# Altium schematic sheet Sheet1.SchDoc
size A4
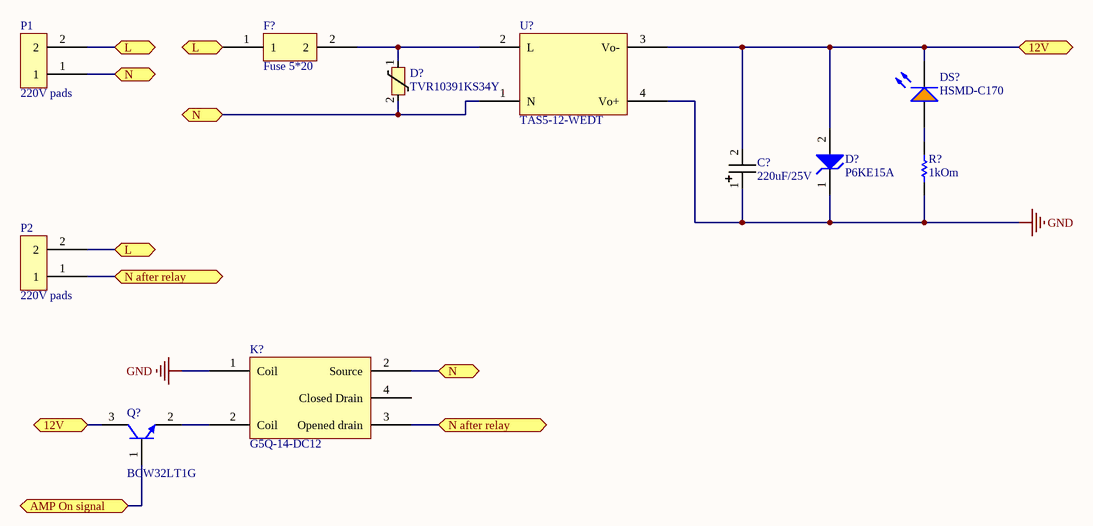
[diagram p0: Sheet1.SchDoc]

## Parts
(Parts that share a designator on the sheet are numbered #1, #2 ... from top to bottom, then left to right.)
C?  220uF/25V  [Capacitor 7*8]
D?#1  TVR10391KS34Y  [TVR10391KS34Y]
D?#2  P6KE15A  [ONSC-SURMETIC40-2-017AA-01]
DS?  HSMD-C170  [AVAG-HSMX-C170_V]
F?  Fuse 5*20  [Fuse 5*20]
K?  G5Q-14-DC12  [G5Q-14-DC12]
P1  220V pads  [220V pads]
P2  220V pads  [220V pads]
Q?  BCW32LT1G  [ONSC-SOT-23-3-318-08_V]
R?  1kOm  [RESC1608X55X30ML20T10]
U?  TAS5-12-WEDT  [TAS5-12-WEDT]

## Ports
12V (bidir), AMP On signal (bidir), L (bidir), N (bidir), N after relay (bidir)

## Nets
GND: C?.1 D?#2.1(K) K?.1(Coil) R?.1 U?.4(Vo+)
12V: C?.2 D?#2.2(A) DS?.2(K) Q?.3(C) U?.3(Vo-) ; port 12V
AMP On signal: Q?.1(B) ; port AMP On signal
L: F?.1 P1.2 P2.2 ; port L
N: D?#1.2 K?.2(Source) P1.1 U?.1(N) ; port N
N after relay: K?.3(Opened_drain) P2.1 ; port N after relay
NetD?#1_1: D?#1.1 F?.2 U?.2(L)
NetDS?_1: DS?.1(A) R?.2
NetK?_2: K?.2(Coil) Q?.2(E)

Not connected (* = marked no-connect by the designer): K? 4(Closed_Drain)

## Library data of the parts
C? = Capacitor 7*8
D?#2 = CMP-1061-00710-1: 600 W Peak Power Transient Voltage Suppressor, 2-Pin Surmetic(TM) 40, Pb-Free, Bulk Box; Manufacturer: On Semiconductor; PartNumber: P6KE15AG; PPK Max (W): 600; Direction: Unidirectional; V(BR) Typ (V): 15.05; IR Max (uA): 5; Packing: Bulk Box; ComponentLink2URL: http://www.onsemi.com/pub_link/Collateral/P6KE6.8A-D.PDF; ComponentLink1URL: http://www.onsemi.com/; DatasheetVersion: Rev. 10; ComponentLink2Description: Datasheet; ComponentLink3Description: Package Specification; Mounting Technology: Through Hole; PackageReference: SURMETIC40-2-017AA-01; ComponentLink1Description: Manufacturer URL; ComponentLink3URL: http://www.onsemi.cn/pub_link/Collateral/017AA.PDF; PackageVersion: Rev. O, 09/2005; RoHS: Pb-Free; PackageDescription: 2-Pin, Axial Lead, Diameter 3.49 mm
DS? = CMP-2000-06421-1: LED Uni-Color Orange, 52 mW, 20 mA, -40 to 85 degC, 2-Pin SMD, RoHS, Tape and Reel; Manufacturer: Avago; Forward Current If Max: 20mA; External Length / Height: 2mm; Luminous Intensity: 8mcd; Lens Shape: Rectangular; Bulb Size: 1.25mmx1.4mm; External Width: 1.25mm; Wavelength Typ: 605nm; Dominant Wavelength: 604nm; PIV Max: 5V; Opto Mounting Orientation: Top; Viewing Angle: 170°; LED Type: Standard; Forward Voltage: 2.2V; SVHC: NoSVHC(19-Dec-2012); No. of Pins: 2; External Depth: 0.8mm; Power Dissipation Pd: 52mW; Storage Temperature Max: 85°C; Package Description: 2-Pin Surface Mount Device, Body 2 x 1.25 mm, Height 0.8 mm; MSL: MSL2A-4weeks; Operating Temperature Range: -30°Cto+85°C; Datasheet URL: http://docs.avagotech.com/docs/AV02-0551EN; Manufacturer URL: http://www.avagotech.com/; Operating Temperature Min: -30°C; Light Area Height: 1.25mm; Mounting Technology: SurfaceMount; Storage Temperature Min: -40°C; LED Mounting: SMD; Peak Wavelength: 605nm; Package / Case: SMD; Peak Forward Current: 20mA; Forward Voltage VF Max: 2.2V; Mounting Type: SMD; LED Colour: Orange; Forward Current If: 20mA; Operating Temperature Max: 85°C; Voltage Vf Typ: 2.2V; Package Reference: HSMX-C170; Datasheet Version: 03/2012; Opto Case Style: SMD; Luminous Intensity Typ: 8mcd
Q? = CMP-1048-00823-1: General Purpose Transistor, NPN Silicon, 3-Pin SOT-23, Pb-Free, Tape and Reel; Manufacturer: On Semiconductor; IC Continuous (A): 0.1; PackageReference: SOT-23-3-318-08; Polarity: NPN; Mounting Technology: Surface Mount; ComponentLink2URL: http://www.onsemi.com/pub_link/Collateral/BCW32LT1-D.PDF; RoHS: TRUE; PackageVersion: Rev. AP, 11/2009; Packing: Tape and Reel; ComponentLink3Description: Package Specification; PartNumber: BCW32LT1G; ComponentLink1Description: Manufacturer URL; PackageDescription: 3-Pin Small Outline Transistor, Body 2.92 x 1.3 mm, Pitch 0.95 mm; ComponentLink3URL: http://www.onsemi.cn/pub_link/Collateral/318-08.PDF; ComponentLink1URL: http://www.onsemi.com/; DatasheetVersion: Rev. 2; ComponentLink2Description: Datasheet
R? = CMP-2000-01555-1: Part Number: RK73H1JTTD5101F; Manufacturer: KOA Speer
D?#1 = TVR10391KS34Y: ComponentLink1Description: https://lcsc.com/product-detail/Varistors_TKS-TVR10391KS34Y_C2760960.html; ComponentLink1URL: *
F? = Fuse 5*20: ComponentLink1Description: https://lcsc.com/product-detail/span-style-background-color-ff0-Fuse-span-Holders_Xucheng-Elec-C3130_C3130.html; ComponentLink1URL: *
K? = G5Q-14-DC12: ComponentLink1Description: https://lcsc.com/product-detail/Relays_Omron-Electronics-G5Q-14-DC12_C225715.html; ComponentLink1URL: *
U? = TAS5-12-WEDT: ComponentLink1Description: https://lcsc.com/product-detail/Power-Modules_TDPOWER-TAS5-12-WEDT_C2687652.html; ComponentLink1URL: *